# Altium schematic sheet Serial.SchDoc: Ixora
size A3; Organization: Toradex AG; Address1: Altsagenstrasse 5; Address2: Horw; Address3: 6048; Address4: Switzerland; DocumentNumber: 16; Revision: V1.1; SheetNumber: 12; SheetTotal: 17; PageSetup: Record=PageOptions|CenterHorizontal=True|CenterVertical=True|PrintScale=0.73|XCorrection=1.00|YCorrection=1.00|PrintKind=0|BorderSize=5000000|LeftOffset=0|BottomOffset=0|Orientation=2|PaperLength=1000|PaperWidth=1000|Scale=100|PaperSource=7|PrintQuality=-4|MediaType=1|DitherType=10|PaperKind=A4|PrintScaleMode=1
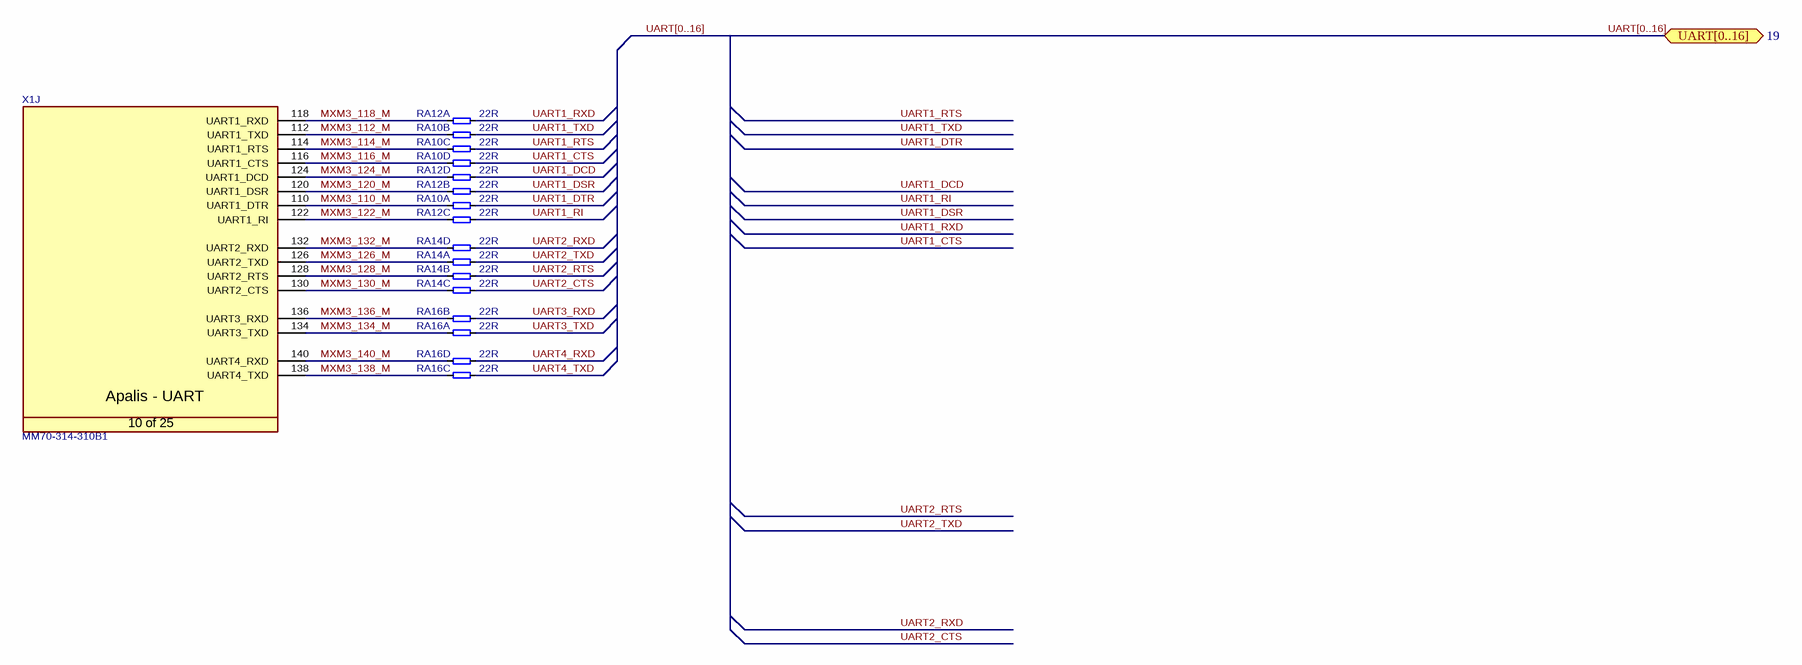
[diagram p0: Serial.SchDoc]

## Parts
RA10  22R  [T_Resistor_Array_X4]  (parts A,B,C,D of 4)
RA12  22R  [T_Resistor_Array_X4]  (parts A,B,C,D of 4)
RA14  22R  [T_Resistor_Array_X4]  (parts A,B,C,D of 4)
RA16  22R  [T_Resistor_Array_X4]  (parts A,B,C,D of 4)
X1  Manufacturer Part No.: MM70-314-310B1  [T_JAE_MM70-314-310B1]  (hidden comment: CON-JAE-MM70-314-310B1-314-0.5mm)  (part J of 25)

## Ports
UART[0..16] (bidir, see 19)

## Nets
MXM3_110_M: RA10.1 X1.110(UART1_DTR)
MXM3_112_M: RA10.2 X1.112(UART1_TXD)
MXM3_114_M: RA10.3 X1.114(UART1_RTS)
MXM3_116_M: RA10.4 X1.116(UART1_CTS)
MXM3_118_M: RA12.1 X1.118(UART1_RXD)
MXM3_120_M: RA12.2 X1.120(UART1_DSR)
MXM3_122_M: RA12.3 X1.122(UART1_RI)
MXM3_124_M: RA12.4 X1.124(UART1_DCD)
MXM3_126_M: RA14.1 X1.126(UART2_TXD)
MXM3_128_M: RA14.2 X1.128(UART2_RTS)
MXM3_130_M: RA14.3 X1.130(UART2_CTS)
MXM3_132_M: RA14.4 X1.132(UART2_RXD)
MXM3_134_M: RA16.1 X1.134(UART3_TXD)
MXM3_136_M: RA16.2 X1.136(UART3_RXD)
MXM3_138_M: RA16.3 X1.138(UART4_TXD)
MXM3_140_M: RA16.4 X1.140(UART4_RXD)
UART1_CTS: RA10.8
UART1_DCD: RA12.8
UART1_DSR: RA12.6
UART1_DTR: RA10.5
UART1_RI: RA12.7
UART1_RTS: RA10.7
UART1_RXD: RA12.5
UART1_TXD: RA10.6
UART2_CTS: RA14.7
UART2_RTS: RA14.6
UART2_RXD: RA14.8
UART2_TXD: RA14.5
UART3_RXD: RA16.6
UART3_TXD: RA16.5
UART4_RXD: RA16.8
UART4_TXD: RA16.7

## Buses and harness runs
bus UART[0..16] = port UART[0..16]

## Notes on the sheet
- Title
- Size:
- Date:
- A3
- Number:
- Time:
- Revision:
- Sheet
- of
- File:
- (in symbol CON-JAE-MM70-314-310B1-314-0.5mm, part J) Apalis - UART; 10 of 25

## Library data of the parts
RA10 RA12 RA14 RA16 = RA-22R-63mW-5%-1206-div: Resistor Array 22 R 63mW 5% 1206; Tolerance: 5%; Power Dissipation: 63mW; Value: 22R
X1 = CON-JAE-MM70-314-310B1-314-0.5mm: MXM3 Connector; Manufacturer Name: JAE; No. of ways: 314